# Altium schematic sheet TOP.SchDoc: =DocumentName
size A4; Organization: Queen's Formula SAE; Address1: 130 Stuart St, Kingston; Address2: Ontario; Address3: Canada; Address4: K7L 2V9; DocumentNumber: 1; Revision: 0; SheetNumber: 1; SheetTotal: 1
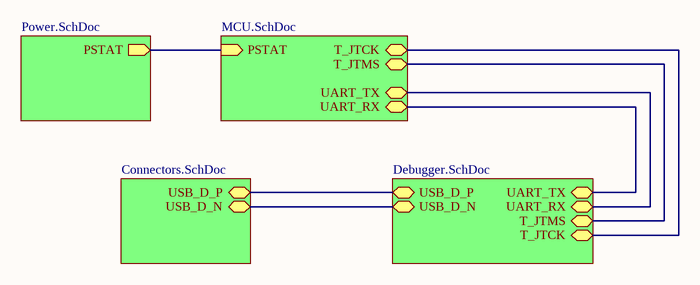
[diagram p0: TOP.SchDoc]

## Sub-sheets
Connectors = Connectors.SchDoc: USB_D_P (bidir), USB_D_N (bidir)
Debugger = Debugger.SchDoc: USB_D_P (bidir), USB_D_N (bidir), UART_TX (bidir), UART_RX (bidir), T_JTMS (bidir), T_JTCK (bidir)
MCU = MCU.SchDoc: UART_TX (bidir), UART_RX (bidir), PSTAT (in), T_JTCK (bidir), T_JTMS (bidir)
Power = Power.SchDoc: PSTAT (out)

## Nets
(unnamed): sheet Power/PSTAT, sheet MCU/PSTAT
(unnamed): sheet MCU/UART_TX, sheet Debugger/UART_RX
(unnamed): sheet MCU/UART_RX, sheet Debugger/UART_TX
(unnamed): sheet MCU/T_JTCK, sheet Debugger/T_JTCK
(unnamed): sheet MCU/T_JTMS, sheet Debugger/T_JTMS
(unnamed): sheet Connectors/USB_D_P, sheet Debugger/USB_D_P
(unnamed): sheet Connectors/USB_D_N, sheet Debugger/USB_D_N

## Notes on the sheet
- Title
- Size:
- Date:
- A4
- Number:
- Time:
- Revision:
- Sheet
- of
- File: